# EAGLE design LEDLamp_CapTIvate (EAGLE 7.2.0)
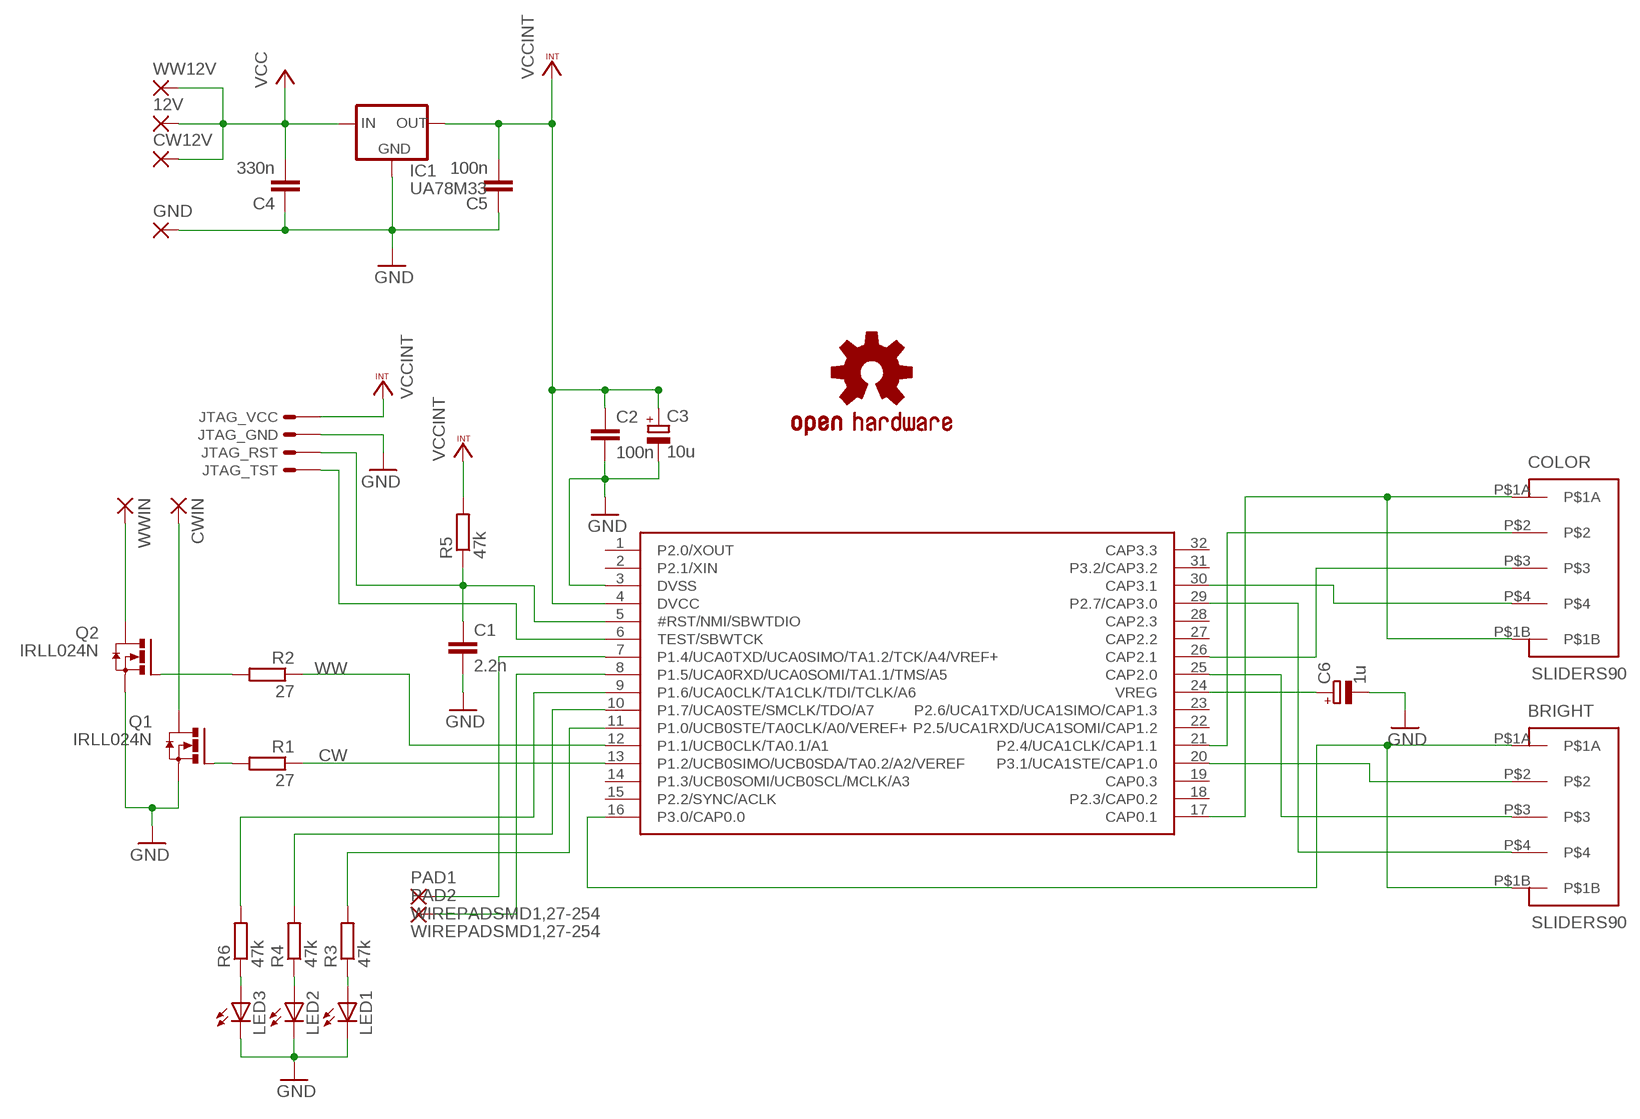
[diagram p0: schematic, sheet 1]

## Parts
12V  SMD5  [SMD2,54-5,08]
BRIGHT  SLIDERS90  [SLIDER90]
C1  2.2n  C-EUC0805  [C0805]
C2  100n  C-EUC0805  [C0805]
C3  10u  CPOL-EUR/2012-12R  [R/2012-12R]
C4  330n  C-EUC0805  [C0805]
C5  100n  C-EUC0805  [C0805]
C6  1u  CPOL-EUR/2012-12R  [R/2012-12R]
COLOR  SLIDERS90  [SLIDER90]
CW12V  SMD5  [SMD2,54-5,08]
CWIN  SMD5  [SMD2,54-5,08]
GND  SMD5  [SMD2,54-5,08]
IC1  UA78M33  UA78M05DCY  [SOT223]
JTAG_  MSP430SBWMPE  [MPE-374-04]
LED1  LEDTOPLED-SANTANA  [MINI-TOPLED-SANTANA]
LED2  LEDTOPLED-SANTANA  [MINI-TOPLED-SANTANA]
LED3  LEDTOPLED-SANTANA  [MINI-TOPLED-SANTANA]
MSP430FR2633  FR2633  [DA32]
PAD1  WIREPADSMD1,27-254  WIREPADSMD3X1,5  [SMD3X1.5]
PAD2  WIREPADSMD1,27-254  WIREPADSMD3X1,5  [SMD3X1.5]
Q1  IRLL024N  N-HEXFET-2D_SOT232-  [SOT223]
Q2  IRLL024N  N-HEXFET-2D_SOT232-  [SOT223]
R1  27  R-EU_R0805  [R0805]
R2  27  R-EU_R0805  [R0805]
R3  47k  R-EU_R0805  [R0805]
R4  47k  R-EU_R0805  [R0805]
R5  47k  R-EU_R0805  [R0805]
R6  47k  R-EU_R0805  [R0805]
U$2  OSHW_LOGO_SYMM  [OSHW_LOGO_MED_SYM]
WW12V  SMD5  [SMD2,54-5,08]
WWIN  SMD5  [SMD2,54-5,08]

## Nets
CW: MSP430FR2633.13(P1.2/UCB0SIMO/UCB0SDA/TA0.2/A2/VEREF) R1.1
GND: C1.2 C2.2 C3.- C4.1 C5.1 C6.- GND.1(P) IC1.2(GND) JTAG_.P$2 LED1.C LED2.C LED3.C MSP430FR2633.3(DVSS) Q1.3(S) Q2.3(S)
N$1: BRIGHT.P$1A BRIGHT.P$1B MSP430FR2633.16(P3.0/CAP0.0)
N$2: BRIGHT.P$2 MSP430FR2633.20(P3.1/UCA1STE/CAP1.0)
N$3: BRIGHT.P$3 MSP430FR2633.25(CAP2.0)
N$4: BRIGHT.P$4 MSP430FR2633.29(P2.7/CAP3.0)
N$5: COLOR.P$1A COLOR.P$1B MSP430FR2633.17(CAP0.1)
N$6: COLOR.P$2 MSP430FR2633.21(P2.4/UCA1CLK/CAP1.1)
N$7: COLOR.P$3 MSP430FR2633.26(CAP2.1)
N$8: COLOR.P$4 MSP430FR2633.30(CAP3.1)
N$9: Q1.1(G) R1.2
N$10: Q2.1(G) R2.2
N$11: Q2.2(D) Q2.4(D) WWIN.1(P)
N$12: CWIN.1(P) Q1.2(D) Q1.4(D)
N$14: LED3.A R6.1
N$15: LED2.A R4.1
N$16: LED1.A R3.1
N$18: MSP430FR2633.11(P1.0/UCB0STE/TA0CLK/A0/VEREF+) R3.2
N$19: MSP430FR2633.10(P1.7/UCA0STE/SMCLK/TDO/A7) R4.2
N$20: MSP430FR2633.9(P1.6/UCA0CLK/TA1CLK/TDI/TCLK/A6) R6.2
N$21: C6.+ MSP430FR2633.24(VREG)
RST: C1.1 JTAG_.P$3 MSP430FR2633.5(#RST/NMI/SBWTDIO) R5.1
RX: MSP430FR2633.8(P1.5/UCA0RXD/UCA0SOMI/TA1.1/TMS/A5) PAD2.P$1(P)
TST: JTAG_.P$4 MSP430FR2633.6(TEST/SBWTCK)
TX: MSP430FR2633.7(P1.4/UCA0TXD/UCA0SIMO/TA1.2/TCK/A4/VREF+) PAD1.P$1(P)
VCC: 12V.1(P) C4.2 CW12V.1(P) IC1.1(IN) WW12V.1(P)
VCCINT: C2.1 C3.+ C5.2 IC1.3(OUT) JTAG_.P$1 MSP430FR2633.4(DVCC) R5.2
WW: MSP430FR2633.12(P1.1/UCB0CLK/TA0.1/A1) R2.1
Unconnected: MSP430FR2633.1(P2.0/XOUT) MSP430FR2633.2(P2.1/XIN) MSP430FR2633.14(P1.3/UCB0SOMI/UCB0SCL/MCLK/A3) MSP430FR2633.15(P2.2/SYNC/ACLK) MSP430FR2633.18(P2.3/CAP0.2) MSP430FR2633.19(CAP0.3) MSP430FR2633.22(P2.5/UCA1RXD/UCA1SOMI/CAP1.2) MSP430FR2633.23(P2.6/UCA1TXD/UCA1SIMO/CAP1.3) MSP430FR2633.27(CAP2.2) MSP430FR2633.28(CAP2.3) MSP430FR2633.31(P3.2/CAP3.2) MSP430FR2633.32(CAP3.3)

## Library data of the parts
12V CW12V CWIN GND WW12V WWIN = wirepad:SMD5: SMD PAD
BRIGHT COLOR = CapTIvate:SLIDERS: CapTIvate Touch Technology Elements
C1 C2 C4 C5 = rcl:C-EU: CAPACITOR, European symbol
C3 C6 = rcl:CPOL-EU: POLARIZED CAPACITOR, European symbol
IC1 = MSP430_Lab:UA78M05*: UA78M05 5V Positive Voltage Regulator SOT 223 Package
JTAG_ = GG_JTAG:MSP430SBW
LED1-LED3 = led:LED: LED OSRAM: - CHIPLED LG R971, LG N971, LY N971, LG Q971, LY Q971, LO R971, LY R971 LH N974, LH R974 LS Q976, LO Q976, LY Q976 LO Q996 - Hyper CHIPLED LW Q18S LB Q993, LB Q99A, LB R99A - SideLED LS A670, LO A670, LY A670, LG A670, LP A670 LB A673, LV A673, LT A673, LW A673 LH A674 LY A675 LS A676, LA A676, LO A676, LY A676, LW A676 LS A679, LY A679, LG A679 - Hyper Micro SIDELED® LS Y876, LA Y876, LO Y876, LY Y876 LT Y87S - SmartLED LW L88C, LW L88S LB L89C, LB L89S, LG L890 LS L89K, LO L89K, LY L89K LS L896, LA L896, LO L896, LY L896 - TOPLED LS T670, LO T670, LY T670, LG T670, LP T670 LSG T670, LSP T670, LSY T670, LOP T670, LYG T670 LG T671, LOG T671, LSG T671 LB T673, LV T673, LT T673, LW T673 LH T674 LS T676, LA T676, LO T676, LY T676, LB T676, LH T676, LSB T676, LW T676 LB T67C, LV T67C, LT T67C, LS T67K, LO T67K, LY T67K, LW E67C LS E67B, LA E67B, LO E67B, LY E67B, LB E67C, LV E67C, LT E67C LW T67C LS T679, LY T679, LG T679 LS T770, LO T770, LY T770, LG T770, LP T770 LB T773, LV T773, LT T773, LW T773 LH T774 LS E675, LA E675, LY E675, LS T675 LS T776, LA T776, LO T776, LY T776, LB T776 LHGB T686 LT T68C, LB T68C - Hyper Mini TOPLED® LB M676 - Mini TOPLED Santana® LG M470 LS M47K, LO M47K, LY M47K Source: http://www.osram.convergy.de LUXEON: - LUMILED® LXK2-PW12-R00, LXK2-PW12-S00, LXK2-PW14-U00, LXK2-PW14-V00 LXK2-PM12-R00, LXK2-PM12-S00, LXK2-PM14-U00 LXK2-PE12-Q00, LXK2-PE12-R00, LXK2-PE12-S00, LXK2-PE14-T00, LXK2-PE14-U00 LXK2-PB12-K00, LXK2-PB12-L00, LXK2-PB12-M00, LXK2-PB14-N00, LXK2-PB14-P00, LXK2-PB14-Q00 LXK2-PR12-L00, LXK2-PR12-M00, LXK2-PR14-Q00, LXK2-PR14-R00 LXK2-PD12-Q00, LXK2-PD12-R00, LXK2-PD12-S00 LXK2-PH12-R00, LXK2-PH12-S00 LXK2-PL12-P00, LXK2-PL12-Q00, LXK2-PL12-R00 Source: www.luxeon.com KINGBRIGHT: KA-3528ASYC Source: www.kingbright.com
MSP430FR2633 = MSP430_Devices_GG:FR2633
PAD1 PAD2 = wirepad:WIREPAD: Wire PAD connect wire on PCB
Q1 Q2 = transistor-power:N-HEXFET-2D_?-*: HEXFET® Power MOSFET 2 Drain connects http://www.irf.com/product-info/datasheets/data/irll014n.pdf
R1-R6 = rcl:R-EU_: RESISTOR, European symbol
U$2 = PatternAgents-Logos:OSHW_LOGO_SYM: OSHW_LOGO_SYM Source : http://freedomdefined.org/OSHW#Logo_repository Github : https://github.com/PatternAgents/PCB_Libraries License : http://creativecommons.org/licenses/by-sa/3.0/ (Creative Commons 3.0) THIS SOFTWARE IS PROVIDED BY THE CONTRIBUTORS "AS IS" AND WITHOUT ANY EXPRESS OR IMPLIED WARRANTIES, INCLUDING, BUT NOT LIMITED TO, THE IMPLIED WARRANTIES OF MERCHANTABILITY AND FITNESS FOR A PARTICULAR PURPOSE ARE DISCLAIMED. IN NO EVENT SHALL THE COPYRIGHT OWNER OR CONTRIBUTORS BE LIABLE FOR ANY DIRECT, INDIRECT, INCIDENTAL, SPECIAL, EXEMPLARY, OR CONSEQUENTIAL DAMAGES (INCLUDING, BUT NOT LIMITED TO, PROCUREMENT OF SUBSTITUTE GOODS OR SERVICES; LOSS OF USE, DATA, OR PROFITS; OR BUSINESS INTERRUPTION) HOWEVER CAUSED AND ON ANY THEORY OF LIABILITY, WHETHER IN CONTRACT, STRICT LIABILITY, OR TORT (INCLUDING NEGLIGENCE OR OTHERWISE) ARISING IN ANY WAY OUT OF THE USE OF THIS SOFTWARE, EVEN IF ADVISED OF THE POSSIBILITY OF SUCH DAMAGE.

## Board
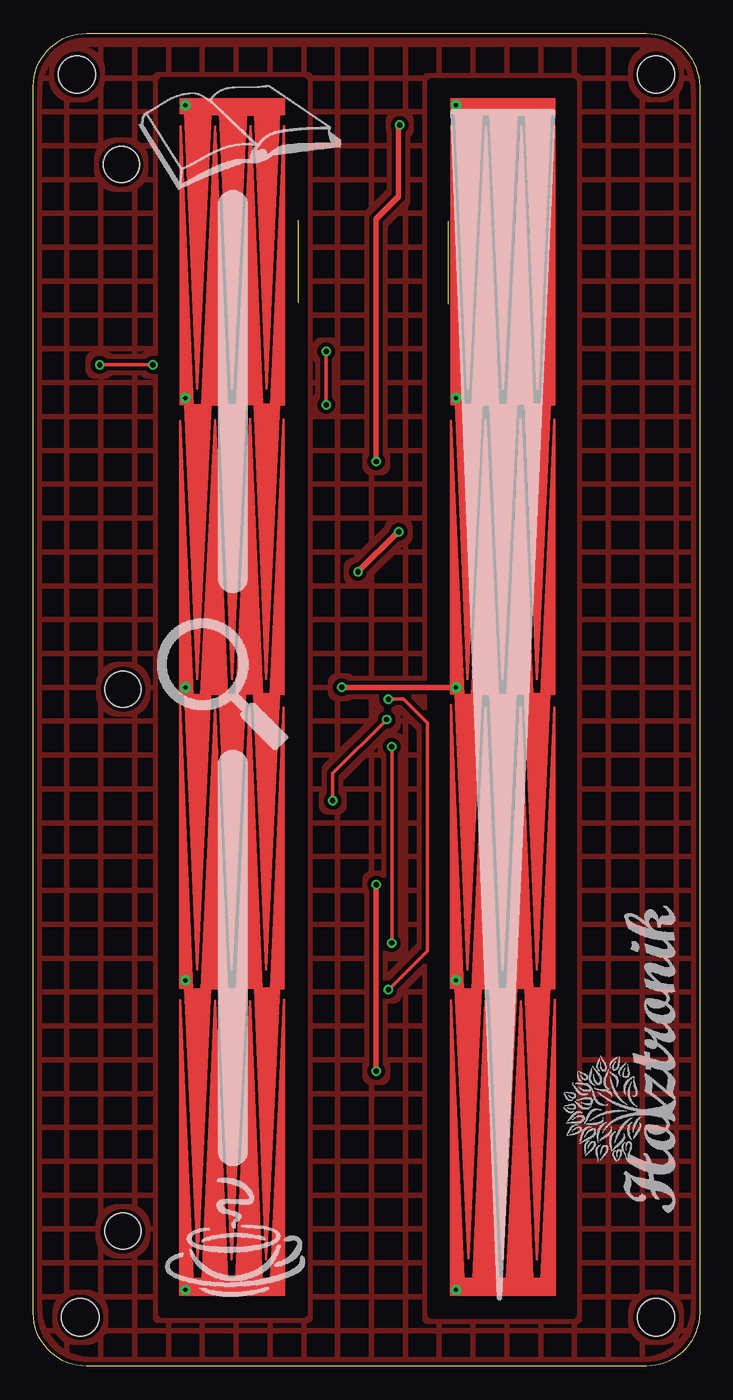
[diagram p1: board, top side]
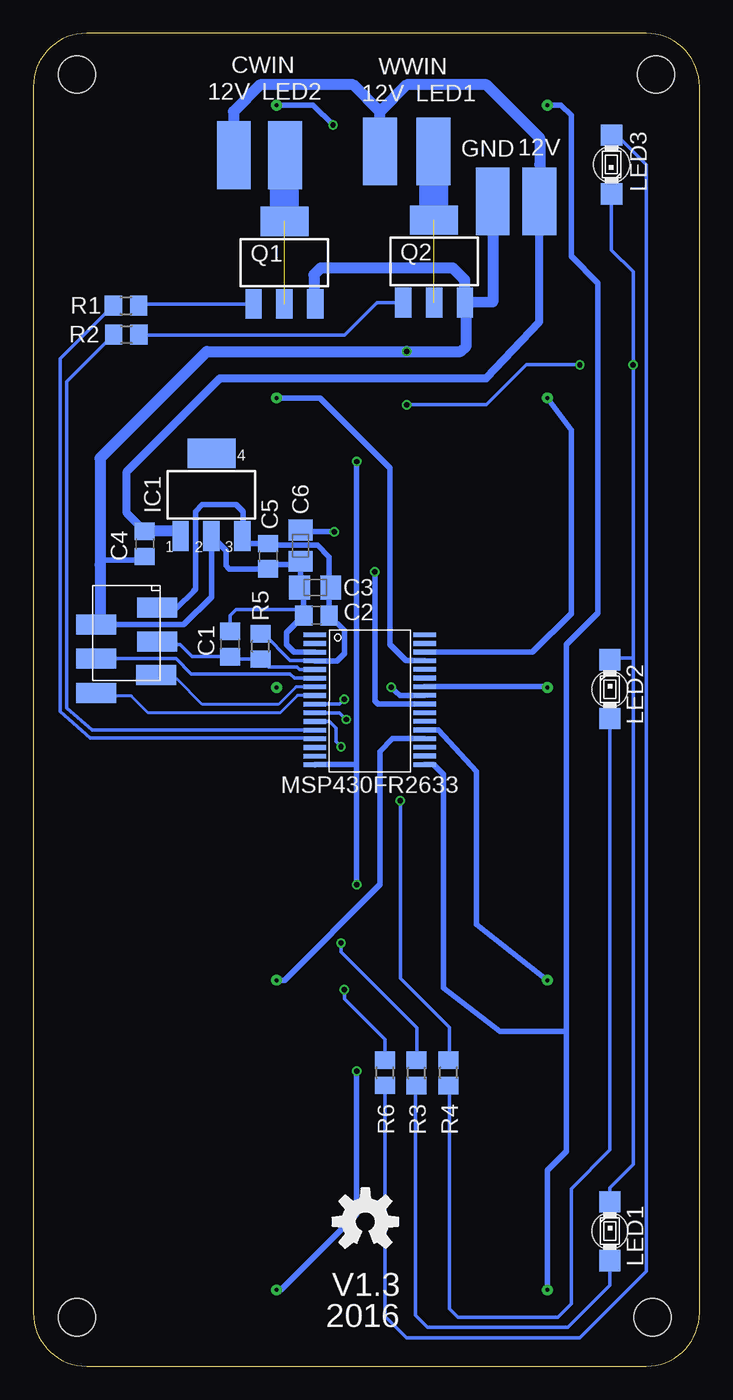
[diagram p2: board, bottom side, seen from below]

Size 50 x 100 mm. Coordinates in mm from the lower left corner, seen from the top.
Outline: 0,4 0,96 arc-90 4,100 46,100 arc-90 50,96 50,4 arc-90 46,0 4,0 arc-90 0,4
Copper layers (1*16): Top 0.035mm / dielectric 1.5mm / Bottom 0.035mm
Design rules "Elecrow_2-layer_eagle_rule": minimum track width 6mil, minimum drill 12mil, track to track 6mil, track to pad 6mil, pad to pad 6mil, via to via 6mil, smd to smd 0mil, copper to edge 10mil, drill to drill 10mil, minimum pad ring 10mil, minimum via ring 6mil, stop-mask expansion 2mil, vias tented up to drill 100mil, thermal gap 10mil
Holes 2.8 mm at 3.27,96.92 46.73,96.92 46.73,3.67 3.52,3.67
tRestrict: area 9.6,3.9 to 20.3,96.4; area 29.9,3.9 to 40.5,96.3

### Footprints (pad centres in the part's own frame; a part is rotated, then mirrored left to right if it is on the bottom)
SMD2,54-5,08 = smd 2.54 x 5.08: 1 0,0
SLIDER90 = drill 0.305: P$1A 0.508,7.62; P$1B 89.408,7.62; P$2 23.749,7.62; P$3 45.72,7.62; P$4 67.437,7.62
C0805 = smd 1.3 x 1.5: 1 -0.95,0; 2 0.95,0
R/2012-12R = smd 1.55 x 1.8: + 1.175,0; - -1.175,0
SOT223 = smd 1.219 x 2.235: 1 -2.311,-3.099; 2 0,-3.099; 3 2.311,-3.099 | smd 3.6 x 2.2: 4 0,3.099
MPE-374-04 = smd 1.5 x 3: P$1 2.54,-2.286; P$2 1.27,2.286; P$3 0,-2.286; P$4 -1.27,2.286
MINI-TOPLED-SANTANA = smd 1.6 x 1.6: A 0,2.2; C 0,-2.2 | hole 2.7: 0,0
DA32 = smd 0.35 x 1.705: 1 -4.58,-4.12; 2 -3.93,-4.12; 3 -3.28,-4.12; 4 -2.63,-4.12; 5 -1.98,-4.12; 6 -1.33,-4.12; 7 -0.68,-4.12; 8 -0.03,-4.12; 9 0.62,-4.12; 10 1.27,-4.12; 11 1.92,-4.12; 12 2.57,-4.12; 13 3.22,-4.12; 14 3.87,-4.12; 15 4.52,-4.12; 16 5.17,-4.12; 17 5.165,4.114; 18 4.516,4.114; 19 3.865,4.114; 20 3.215,4.114; 21 2.565,4.114; 22 1.915,4.114; 23 1.265,4.114; 24 0.615,4.114; 25 -0.035,4.114; 26 -0.685,4.114; 27 -1.335,4.114; 28 -1.985,4.114; 29 -2.635,4.114; 30 -3.285,4.114; 31 -3.924,4.114; 32 -4.574,4.114
SMD3X1.5 = smd 3 x 1.5: P$1 0,0
R0805 = smd 1.3 x 1.5: 1 -0.95,0; 2 0.95,0

### Placement (x,y rotation side)
12V  12.03,87.38 180 bottom
BRIGHT  39.35,5.21 90 top
C1  35.23,54.18 90 bottom
C2  28.75,56.34 180 bottom
C3  28.85,58.43 0 bottom
C4  41.64,61.7 90 bottom
C5  32.37,60.76 90 bottom
C6  29.95,61.55 90 bottom
COLOR  19.03,5.21 90 top
CW12V  34.95,90.86 0 bottom
CWIN  31.09,90.86 0 bottom
GND  15.52,87.38 180 bottom
IC1  36.63,65.38 0 bottom
JTAG_  43.01,54.37 90 bottom
LED1  6.73,10.13 180 bottom
LED2  6.74,50.79 180 bottom
LED3  6.6,90.15 0 bottom
MSP430FR2633  24.75,50.29 270 bottom
PAD1  40.77,51.84 180 bottom
PAD2  45.28,50.49 180 bottom
Q1  31.16,82.79 0 bottom
Q2  19.92,82.89 0 bottom
R1  43.04,79.58 0 bottom
R2  43.02,77.41 0 bottom
R3  21.24,22 90 bottom
R4  18.83,22.01 90 bottom
R5  32.94,54 90 bottom
R6  23.61,22.02 90 bottom
U$2  25.08,10.84 0 bottom
U$3  [HOLZTRONIK5]  49.51,10.54 90 top
U$6  [BUCH1]  7.41,87.83 0 top
U$7  [LUPE1]  9.3,46.27 0 top
U$8  [TASSE1]  9.38,4.89 0 top
WW12V  23.98,91.13 0 bottom
WWIN  19.98,91.13 0 bottom

### Tracks (layer width: path | path; a pad name or v marks a point on that pad's centre or on a via)
CW
  Bottom 0.254: MSP430FR2633.13 28.93,47.07 28.98,47.13 45.73,47.13 47.98,49.13 47.98,75.59 R1.1
GND  (via drill 0.4)
  Top 0.254: v21.98,76.13 v21.98,72.13 | v8.98,75.13 v4.98,75.13
  Bottom 0.254: C1.2 35.23,56.32 34.78,56.77 30.14,56.77 C2.2 | 4.98,53.13 4.98,15.13 6.73,13.38 LED1.C | 4.98,53.13 6.6,53.13 LED2.C | LED3.C 6.6,83.75 4.98,82.13 v4.98,75.13 4.98,53.13 | v21.98,72.13 15.98,72.13 12.98,75.13 v8.98,75.13
  Bottom 0.406: MSP430FR2633.3 30.43,53.57 30.98,54.13 30.98,55.06 C2.2 29.7,58.1 C3.- | JTAG_.P$2 38.71,55.64 36.63,57.71 IC1.2 35.54,61.19 35.54,60.07 35.29,59.82 C5.1 32.05,60.13 29.98,60.13 29.98,60.34 C6.- 29.95,58.51 C3.- | 30.16,58.29 C3.- | C4.1 41.64,60.47 44.64,60.47 44.98,60.13 | 44.98,57.13 44.98,55.95
  Bottom 0.61: 44.98,55.95 JTAG_.P$2 | 17.49,78.94 Q2.3
  Bottom 0.813: Q1.3 28.94,79.79 28.94,81.88 28.43,82.39 18.51,82.39 17.61,81.49 Q2.3 15.52,79.84 GND.1 | 44.98,55.95 44.98,60.13 44.98,68.13 36.98,76.13 v21.98,76.13 17.93,76.13 17.51,76.55 17.49,78.94
N$1  (via drill 0.4)
  Top 0.406: v25.73,67.87 25.73,86.07 27.41,87.76 27.41,93.04 v27.51,93.13 | v25.73,22.13 v25.73,36.13
  Bottom 0.406: BRIGHT.P$1B 28.99,94.62 v27.51,93.13 | v25.73,67.87 25.73,45.13 | 25.73,45.13 MSP430FR2633.16 | BRIGHT.P$1A 31.39,5.72 25.73,11.38 v25.73,22.13 | v25.73,36.13 25.73,45.13
N$2
  Bottom 0.406: BRIGHT.P$2 31.15,28.96 23.98,36.13 23.98,46.13 23.03,47.08 MSP430FR2633.20
N$3  (via drill 0.4)
  Top 0.406: BRIGHT.P$3 v23.14,50.93
  Bottom 0.406: MSP430FR2633.25 22.47,50.33 v23.14,50.93
N$4
  Bottom 0.406: BRIGHT.P$4 28.5,72.64 23.22,67.37 23.22,54.13 22.02,52.93 MSP430FR2633.29
N$5
  Bottom 0.406: 9.98,25.13 9.98,16.11 11.41,14.68 COLOR.P$1A | MSP430FR2633.17 19.98,45.13 19.24,44.38 19.24,28.38 14.98,25.13 9.98,25.13 | COLOR.P$1B 10.4,94.62 9.63,93.85 9.63,83.26 7.62,81.25 7.62,56.49 9.98,54.13 9.98,25.13
N$6
  Bottom 0.406: MSP430FR2633.21 19.58,47.73 16.73,44.62 16.73,33.15 COLOR.P$2
N$7
  Bottom 0.406: MSP430FR2633.26 11.46,50.98 COLOR.P$3
N$8
  Bottom 0.406: COLOR.P$4 9.63,70.23 9.63,56.48 12.53,53.58 MSP430FR2633.30
N$9
  Bottom 0.254: Q1.1 41.97,79.69 R1.2
N$10
  Bottom 0.254: Q2.1 24.21,79.79 26.65,77.34 42,77.34 R2.2
N$11  (1 unrouted)
  Bottom 0.813: 19.92,91.06 WWIN.1
  Bottom 2.184: Q2.4 19.92,91.06
N$12  (1 unrouted)
  Bottom 0.813: 31.16,90.8 CWIN.1
  Bottom 2.184: Q1.4 31.16,90.8
N$13
  pour Top (isolate 0.305, hatched): -0.02,4.13 -0.02,96.13 arc-90 3.98,100.13 45.98,100.13 arc-90 49.98,96.13 49.98,4.13 arc-90 45.98,0.13 3.98,0.13 arc-90
N$14
  Bottom 0.254: R6.1 23.61,3.75 21.98,2.13 8.98,2.13 3.98,7.13 3.98,90.13 5.98,92.13 6.38,92.13 LED3.A
N$15
  Bottom 0.254: LED2.A 6.74,16.22 9.63,13.32 9.63,4.7 10.65,3.68 18.14,3.68 18.78,4.32 18.78,21.01 R4.1
N$16
  Bottom 0.254: LED1.A 6.73,6.07 9.87,2.92 20.43,2.92 21.32,3.81 21.32,20.97 R3.1
N$18  (via drill 0.4)
  Top 0.254: v26.91,46.48 v26.91,31.75
  Bottom 0.254: MSP430FR2633.11 27.78,48.37 27.29,47.88 27.29,46.86 v26.91,46.48 | v26.91,31.75 26.91,31.1 21.19,25.39 21.19,23 R3.2
N$19  (via drill 0.4)
  Top 0.254: v26.52,48.52 22.46,44.45 v22.46,42.42
  Bottom 0.254: MSP430FR2633.10 27.03,49.02 v26.52,48.52 | v22.46,42.42 22.46,29.08 18.78,25.4 18.78,23.01 R4.2
N$20  (via drill 0.4)
  Top 0.254: v26.65,50.04 27.79,50.04 29.57,48.26 29.57,31.16 v26.65,28.24
  Bottom 0.254: MSP430FR2633.9 27.02,49.67 v26.65,50.04 | v26.65,28.24 26.65,27.56 23.6,24.51 R6.2
N$21  (via drill 0.4)
  Top 0.406: v24.37,59.61 v27.41,62.61
  Bottom 0.406: MSP430FR2633.24 24.13,49.68 24.37,49.91 v24.37,59.61 | v27.41,62.61 29.83,62.61 C6.+
RST
  Bottom 0.254: JTAG_.P$3 40.48,54.13 38.98,54.13 38.08,53.23 C1.1 35.06,53.05 R5.1 32.34,52.45 30.21,52.45 30.03,52.27 MSP430FR2633.5
RX
  Bottom 0.21: MSP430FR2633.8 30.18,50.32 31.48,49.02 41.38,49.02 42.65,50.29 45.22,50.29 PAD2.P$1
TST
  Bottom 0.254: JTAG_.P$4 39.3,53.1 38.15,51.94 30.72,51.94 30.39,51.62 MSP430FR2633.6
TX
  Bottom 0.21: MSP430FR2633.7 30.29,50.97 31.61,49.66 37.32,49.66 39.23,51.56 40.67,51.56 PAD1.P$1
VCC
  Bottom 0.406: 39.31,62.65 IC1.1 | 12V.1 11.98,87.38 11.98,87.13 10.98,87.13 12,90.14
  Bottom 0.61: 39.31,62.65 39.5,62.65 | 12V.1 12.03,78.35 16,74.13 35.98,74.13 42.98,67.13 42.98,63.99 C4.2
  Bottom 0.813: WW12V.1 23.98,94.13 | 23.98,94.13 25.98,96.13 32.98,96.13 34.98,94.13 34.98,90.89 CW12V.1 | 12V.1 11.98,88.13 | 23.98,94.13 21.98,96.13 15.98,96.13 12,92.14 12,90.14 11.74,87.87 | 39.31,62.65 C4.2
VCCINT
  Bottom 0.254: R5.2 32.71,54.95 30.72,52.96 28.9,52.96 MSP430FR2633.4
  Bottom 0.406: MSP430FR2633.4 27.2,52.92 26.65,53.47 26.65,55.19 C2.1 27.8,58.3 | 27.8,58.3 C3.+ | 27.8,58.3 27.8,60.71 28.68,61.6 32.25,61.6 C5.2 33.76,61.71 IC1.3 34.27,62.33 34.27,64.14 34.78,64.64 37.32,64.64 37.83,64.14 37.83,58.29 37.98,58.14 37.98,58.13 39.2,56.91 JTAG_.P$1
WW
  Bottom 0.254: MSP430FR2633.12 45.58,47.72 47.49,49.38 47.49,73.89 R2.1

### Text on the board
bNames: LED1 | 12V | LED2 | 12V | V1.3 | 2016